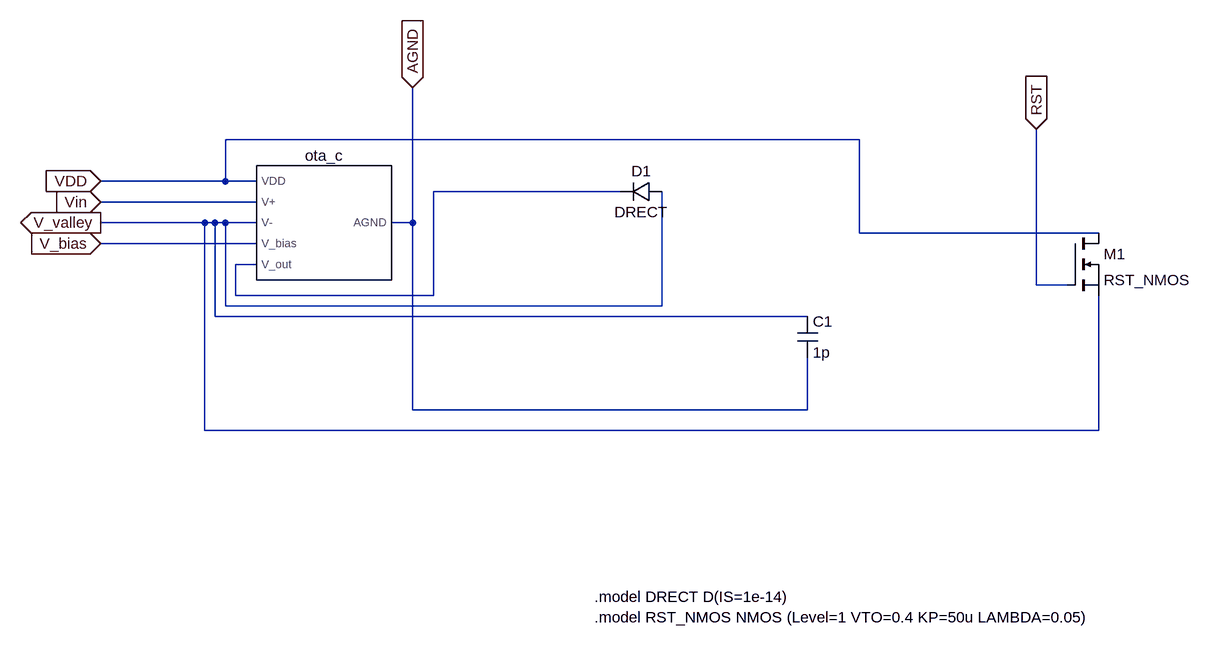
[diagram p0: schematic valley_detector.asc]
valley_detector.asc, the LTspice schematic file:
Version 4.1
SHEET 1 1532 780
WIRE 1024 32 48 32
WIRE 48 96 48 32
WIRE 48 96 -144 96
WIRE 96 96 48 96
WIRE 656 112 368 112
WIRE 96 128 -144 128
WIRE 16 160 -144 160
WIRE 32 160 16 160
WIRE 48 160 32 160
WIRE 96 160 48 160
WIRE 336 160 336 -48
WIRE 336 160 304 160
WIRE 1024 176 1024 32
WIRE 1392 176 1024 176
WIRE 96 192 -144 192
WIRE 96 224 64 224
WIRE 1296 256 1296 16
WIRE 1344 256 1296 256
WIRE 64 272 64 224
WIRE 368 272 368 112
WIRE 368 272 64 272
WIRE 48 288 48 160
WIRE 720 288 720 112
WIRE 720 288 48 288
WIRE 32 304 32 160
WIRE 944 304 32 304
WIRE 336 448 336 160
WIRE 944 448 944 368
WIRE 944 448 336 448
WIRE 16 480 16 160
WIRE 1392 480 1392 272
WIRE 1392 480 16 480
FLAG -144 96 VDD
IOPIN -144 96 In
FLAG -144 128 Vin
IOPIN -144 128 In
FLAG -144 160 V_valley
IOPIN -144 160 Out
FLAG -144 192 V_bias
IOPIN -144 192 In
FLAG 336 -48 AGND
IOPIN 336 -48 In
FLAG 1296 16 RST
IOPIN 1296 16 In
SYMBOL ota_core 192 160 R0
SYMATTR InstName ota_c
SYMBOL diode 720 96 R90
WINDOW 0 0 32 VBottom 2
WINDOW 3 32 32 VTop 2
SYMATTR InstName D1
SYMATTR Value DRECT
SYMBOL cap 928 304 R0
SYMATTR InstName C1
SYMATTR Value 1p
SYMBOL nmos 1344 176 R0
SYMATTR InstName M1
SYMATTR Value RST_NMOS
TEXT 616 736 Left 2 !.model DRECT D(IS=1e-14)\n.model RST_NMOS NMOS (Level=1 VTO=0.4 KP=50u LAMBDA=0.05)

The netlist it stands for:
* valley_detector.asc
X§ota_c VDD Vin V_valley V_bias N001 AGND ota_core  ; pins VDD V+ V- V_bias V_out AGND
D1 V_valley N001 DRECT
C1 V_valley AGND 1p
M1 VDD RST V_valley V_valley RST_NMOS
.model D D
.lib standard.dio
.model NMOS NMOS
.model PMOS PMOS
.lib standard.mos
.model DRECT D(IS=1e-14)
.model RST_NMOS NMOS (Level=1 VTO=0.4 KP=50u LAMBDA=0.05)
.backanno
.end